# Altium project Brakelight.PrjPcb
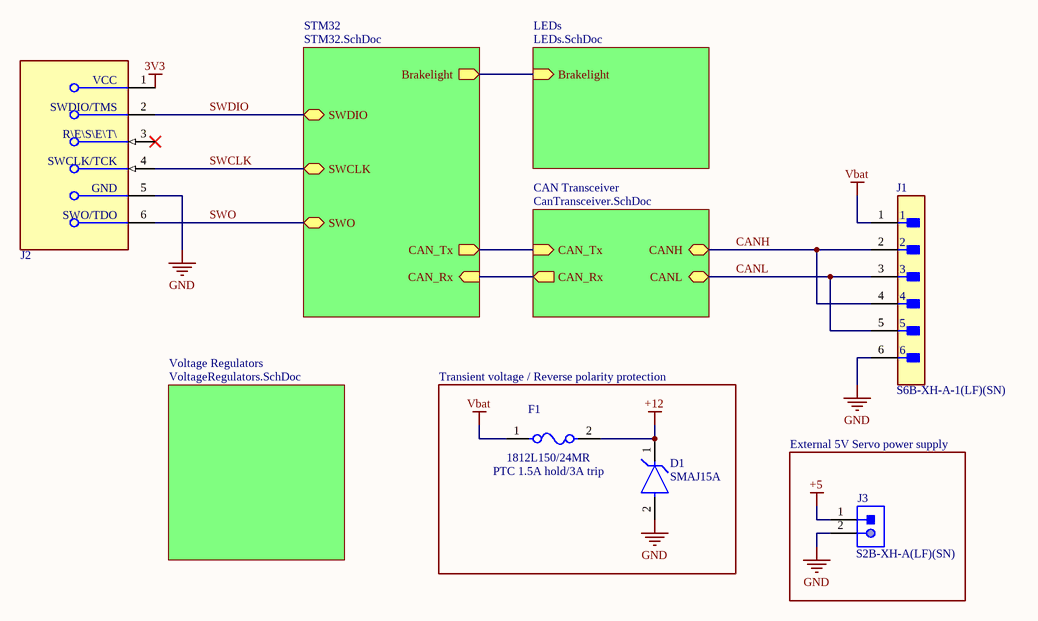
[diagram p0: Brakelight.SchDoc]
5 sheets, 54 parts. Net scope: hierarchical (ports join the sheet entries above them; power ports are global).
Board file: PCB.PcbDoc
Sheets:
  Brakelight.SchDoc
    Voltage Regulators = VoltageRegulators.SchDoc
    LEDs = LEDs.SchDoc
    STM32 = STM32.SchDoc
    CAN Transceiver = CanTransceiver.SchDoc

## Sheet Brakelight.SchDoc
size A; SheetNumber: 1; SheetTotal: 5

### Parts
D1  SMAJ15A  [FP-SMA-MFG]
F1  1812L150/24MR  [FP-1812L-MFG]
J1  S6B-XH-A-1(LF)(SN)  [FP-S6B-XH-A-1_LF_SN-MFG]
J2  TC2030-CTX-NL  [Tag_Connect_0_MFG]  (value not drawn)
J3  S2B-XH-A(LF)(SN)  [JST-S2B-XH-A(LF)(SN)_V]

### Blocks framed on the sheet
External 5V Servo power supply: J3

### Sub-sheets
CAN Transceiver = CanTransceiver.SchDoc: CANL (bidir), CAN_Tx (in), CANH (bidir), CAN_Rx (out)
LEDs = LEDs.SchDoc: Brakelight (in)
STM32 = STM32.SchDoc: CAN_Tx (out), CAN_Rx (in), Brakelight (out), SWDIO (bidir), SWO (bidir), SWCLK (bidir)
Voltage Regulators = VoltageRegulators.SchDoc: no entries

### Nets
3V3: J2.1(VCC)
+5: J3.1
+12: D1.1(C) F1.2
GND: D1.2(A) J1.6 J2.5(GND) J3.2
Vbat: F1.1 J1.1
CANH: J1.2 J1.4 ; sheet CAN Transceiver/CANH
CANL: J1.3 J1.5 ; sheet CAN Transceiver/CANL
SWCLK: J2.4(SWCLK/TCK) ; sheet STM32/SWCLK
SWDIO: J2.2(SWDIO/TMS) ; sheet STM32/SWDIO
SWO: J2.6(SWO/TDO) ; sheet STM32/SWO
NetR7_1: sheet LEDs/Brakelight, sheet STM32/Brakelight
NetU2_32: sheet STM32/CAN_Rx, sheet CAN Transceiver/CAN_Rx
NetU2_33: sheet STM32/CAN_Tx, sheet CAN Transceiver/CAN_Tx

Not connected (* = marked no-connect by the designer): J2 3(~{RESET})*

### Notes on the sheet
- Transient voltage / Reverse polarity protection
- PTC 1.5A hold/3A trip

### Library data of the parts
D1 = CMP-07401-000026-1: TVS DIODE 15V 24.4V SMA; Manufacturer: Bourns Inc.; Max Junction Temp: +150°C; Peak Pulse Current: 16.4A; Direction: Unidirectional; Breakdown Voltage: 16.7V; Number Of Channels: 1; Peak Pulse Power: 400W; Mouser Description: Bourns Smaj15a / Diode Tvs 15v 400w Uni 5% Smd Bourns; Temperature Range Low: -55°C; ComponentLink2Description: Datasheet; Package: SMA; Reverse Standoff Voltage: 15V; Category: Diode; Device Class L2: TVS Diodes; Lead Free: Yes; RoHS: TRUE; Clamping Voltage: 24.4V; ComponentLink2URL: https://www.bourns.com/docs/Product-Datasheets/SMAJ.pdf; Digikey Description: TVS DIODE 15V 24.4V SMA; Temperature Range High: +150°C; Height: 2.29mm; Device Class L1: Circuit Protection; Device Class L3: unset; Temperature: -55°C to +150°C; Octopart: https://octopart.com/smaj15a-bourns-12809353; Manufacturer Part Number: SMAJ15A; Automotive: No
F1 = CMP-08606-000018-1: PTC RESET FUSE 24V 1.5A 1812; Manufacturer: Littelfuse Inc; Trip Current: 3A; Resistance: 0.04-0.12Ω; Current Rating: 20A; Trip Time: 1.5s; Value: 0.04-0.12Ω; Mouser Description: Resettable Fuses - PPTC 24V 1.5A-HD 40A MAX; Ipc Land Pattern Name: CAPC455324X130; Lead Free: Yes; Height: 1.8mm; RoHS: TRUE; Octopart: https://octopart.com/1812l150%2F24mr-littelfuse-7130198; Ambient Temperature Range Low: -40°C; Temperature Range High: +85°C; Automotive: No; Hold Current: 1.5A; Package: 1812L; ComponentLink2Description: Datasheet; Temperature: -40°C to +85°C; Digikey Description: PTC RESET FUSE 24V 1.5A 1812; Device Class L3: unset; ComponentLink2URL: https://www.littelfuse.com/~/media/electronics/datasheets/resettable_ptcs/littelfuse_ptc_1812l_datasheet.pdf.pdf; Voltage Rating: 24V; Device Class L2: PTC Resettable Fuses; Device Class L1: Circuit Protection; Temperature Range Low: -40°C; Manufacturer Part Number: 1812L150/24MR; Category: Fuse; Ambient Temperature Range High: +85°C
J1 = CMP-17439-000023-1: CONN HEADER R/A P6OS 2.5MM; Voltage Rating: 250V; Insulation Resistance: 1GR; Current Rating: 3A; Number of Positions: 6; Gender: Male; Mount: Through Hole; Material: Polyamide; Max Operating Temperature: 85°C; Contact Plating: Tin; Number of Rows: 1; Color: Natural; Termination: Crimp; Min Operating Temperature: -25°C; Pitch: 2.5mm; Lead Free: Lead Free; Contact Material: Brass
J3 = CMP-1755-00005-1: Male Header, Pitch 2.5 mm, 1 x 2 Position, Height 6.1 mm, Tail Length 3.4 mm, -25 to 85 degC, RoHS, Bulk; Type (Capacitors): X7R; Voltage Rating (DC): 100 V; Tolerance: 10%; Capacitance: 1 nF; Case\Package: Radial; Min Operating Temperature: -55 degC; Mount: Through Hole; Package Quantity: 500; PackageReference: S2B-XH-A(LF)(SN); ComponentLink1Description: Manufacturer URL; Max Operating Temperature: 125 degC; ComponentLink2Description: Datasheet; RoHSCompliant: true; PackageDescription: Male Header, Pitch 2.5 mm, 1 x 2 Position, Height 6.1 mm, Tail Length 3.4 mm; REACH SVHC: No SVHC; Packaging: Bulk; Width: 3.81 mm; Length: 5.33 mm; Height: 2.54 mm; Pins: 2; Radiation Hardening: No; ComponentLink1URL: http://www.jst.com/home2.html; Lead Pitch: 2.54 mm; DatasheetVersion: May-16; Voltage Rating: 100 V; ComponentLink2URL: http://www.jst-mfg.com/product/pdf/eng/eXH.pdf

## Sheet VoltageRegulators.SchDoc
size A; SheetNumber: 2; SheetTotal: 5
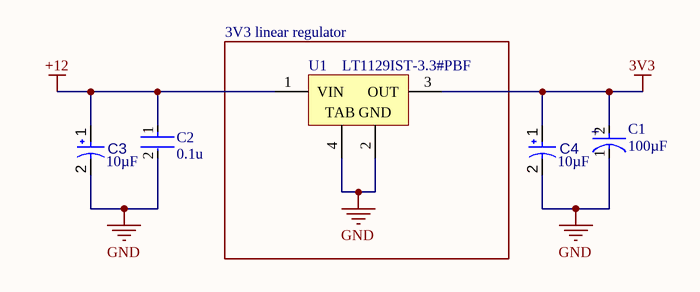
[diagram p1: VoltageRegulators.SchDoc]

### Parts
C1  100µF  [FP-T491X107K025AT-MFG]
C2  0.1u  [FP-C0603C-CF-MFG]
C3  value 10µF  [CAPMP3217X18-T_V]  (hidden comment: TAJA106K016RNJ)
C4  value 10µF  [CAPMP3217X18-T_V]  (hidden comment: TAJA106K016RNJ)
U1  LT1129IST-3.3#PBF  [LT-ST-3-SOT-223_L]

### Blocks framed on the sheet
3V3 linear regulator: U1

### Nets
3V3: C1.2(A) C4.1 U1.3(OUT)
+12: C2.1 C3.1 U1.1(VIN)
GND: C1.1(C) C2.2 C3.2 C4.2 U1.2(GND) U1.4(TAB)

### Notes on the sheet
- (in symbol CMP-2000-07204-2) +

### Library data of the parts
C1 = CMP-2000-07204-2: CAP TANT 100UF 10% 25V 2917; Leakage Current: 25uA; Ripple Current: 742mA; Polarity: Polar; Dissipation Factor: 8%; Life (Hours): 2000Hour; Dielectric Material: Tantalum; ESR (Equivalent Series Resistance): 300mR; Length: 7.3mm; RoHS Compliant: No; Failure Rate: 0.001%; REACH SVHC: No SVHC; Tolerance: 10%; Mount: Surface Mount; Height - Seated (Max): 0.169inch; Features: General Purpose; Height: 4mm; Package Quantity: 1; Case Code (Metric): 7343; Max Operating Temperature: 125°C; Number of Pins: 2; Radiation Hardening: No; Lead Free: Lead Free; Capacitance: 100uF; Termination: SMD/SMT; Voltage Rating: 25V; Series: T491; Depth: 4.3mm; Construction: Flat; Case/Package: 2917; Min Operating Temperature: -55°C; Voltage Rating (DC): 25V; Width: 4.3mm; Packaging: Tape and Reel; Case Code (Imperial): 2917; Voltage: 25V
C2 = CMP-2006-03061-2: CAP CER 0.1UF 50V X7R 0603; Manufacturer: KEMET; Manufacturer Part Number: C0603C104K5RACTU; Tolerance: 0.1; Temperature Coefficient: 30ppm/°C; Material: Ceramic; Automotive Grade: Grade 1; Value: 0.10 μF; Temperature: -55°C to +125°C; RoHS: TRUE; Temperature Range High: +125°C; Lead Free: Yes; Octopart: https://octopart.com/c0603c104k5ractu-kemet-139244; Digikey Description: CAP CER 0.1UF 50V X7R 0603; Category: Cap; Package: C0603C-CF; ComponentLink2Description: Datasheet; Temperature Range Low: -55°C; Device Class L1: Passive Components; Voltage Rating: 50 V; Automotive: Yes; Device Class L3: Ceramic Capacitors; ComponentLink2URL: https://api.kemet.com/component-edge/download/datasheet/C0603C100J5GACAUTO.pdf; Capacitance: 0.10 μF; Device Class L2: Capacitors; Temperature Characteristic: X7R; Height: 0.87mm
C3 C4 = CMP-001-00041-6: Standard Tantalum, 10 uF, +/- 10%, 16 V, -55 to 125 degC, 1206 (3216 Metric), RoHS, Tape and Reel; Manufacturer: AVX; Voltage Rating: 16V; ESR: 3Ohm; RoHS Compliant: True; Tolerance: 10%; Mounting Technology: SM; Min Operating Temperature: -55°C; Capacitor Type: Tantalum; Max Operating Temperature: 125°C; Case/Package: 1206; Pins: 2; Datasheet URL: http://datasheets.avx.com/TAJ.pdf; Datasheet Version: Feb-16; Manufacturer URL: http://www.avx.com/; Package Description: 2-Pin Surface Mount Device, Body 3.2 x 1.65 mm; Package Quantity: 1; Package Reference: CAPMP3217X18-T; Package URL: http://www.avx.com/download/software/literature/AVX-Footprint-Library.pdf; Packaging: TapeandReel
U1 = CMP-0476-01834-1: Micropower Low Dropout Regulator with Shutdown, 4.15 to 30 V Vin, 3.3 V Vout, 3-pin SOT223 (ST-3), -40 to 125 degC, Pb-Free; Manufacturer: Linear Technology; Vin Min(V): 4.15; Iout(mA): 700; Number of Outputs: 1; Vin Max(V): 30; Dropout Voltage(V): 0.45; PSRR(dB): 64; Discrete Pass Element: no; Shutdown Current(uA): 16; Output Voltage: 3.3 V; Isupply(mA): 0.05; RoHS: TRUE; PartNumber: LT1129IST-3.3#PBF; ComponentLink3URL: http://cds.linear.com/docs/en/packaging/SOT_3_05-08-1630.pdf; PackageReference: ST-3; ComponentLink3Description: Package Specification; PackageDescription: 3-Pin Plastic SOT-223, 3.505 x 6.505 mm Body, Pitch 2.3 mm; Mounting Technology: Surface Mount; DatasheetVersion: Rev. F; ComponentLink2URL: http://cds.linear.com/docs/en/datasheet/112935ff.pdf; ComponentLink1URL: http://www.linear.com/; PackageVersion: Jun-10; ComponentLink2Description: Datasheet; ComponentLink1Description: Manufacturer URL

## Sheet LEDs.SchDoc
size A; SheetNumber: 3; SheetTotal: 5
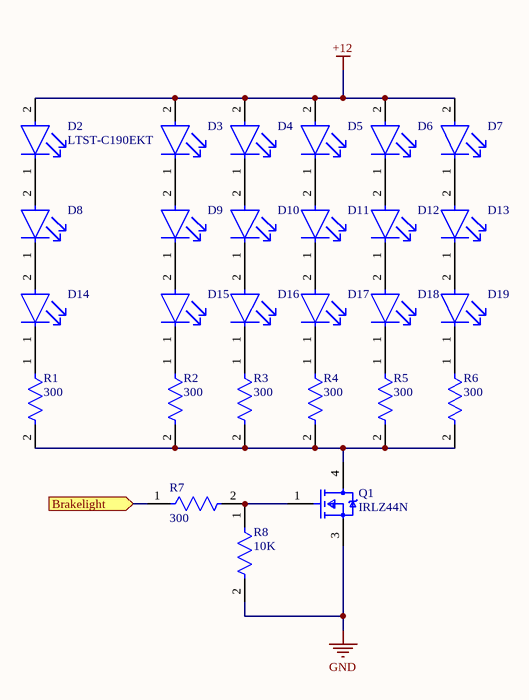
[diagram p2: LEDs.SchDoc]

### Parts
D2  LTST-C190EKT  [FP-LTST-C190EKT-MFG]
D3  LTST-C190EKT  [FP-LTST-C190EKT-MFG]  (value not drawn)
D4  LTST-C190EKT  [FP-LTST-C190EKT-MFG]  (value not drawn)
D5  LTST-C190EKT  [FP-LTST-C190EKT-MFG]  (value not drawn)
D6  LTST-C190EKT  [FP-LTST-C190EKT-MFG]  (value not drawn)
D7  LTST-C190EKT  [FP-LTST-C190EKT-MFG]  (value not drawn)
D8  LTST-C190EKT  [FP-LTST-C190EKT-MFG]  (value not drawn)
D9  LTST-C190EKT  [FP-LTST-C190EKT-MFG]  (value not drawn)
D10  LTST-C190EKT  [FP-LTST-C190EKT-MFG]  (value not drawn)
D11  LTST-C190EKT  [FP-LTST-C190EKT-MFG]  (value not drawn)
D12  LTST-C190EKT  [FP-LTST-C190EKT-MFG]  (value not drawn)
D13  LTST-C190EKT  [FP-LTST-C190EKT-MFG]  (value not drawn)
D14  LTST-C190EKT  [FP-LTST-C190EKT-MFG]  (value not drawn)
D15  LTST-C190EKT  [FP-LTST-C190EKT-MFG]  (value not drawn)
D16  LTST-C190EKT  [FP-LTST-C190EKT-MFG]  (value not drawn)
D17  LTST-C190EKT  [FP-LTST-C190EKT-MFG]  (value not drawn)
D18  LTST-C190EKT  [FP-LTST-C190EKT-MFG]  (value not drawn)
D19  LTST-C190EKT  [FP-LTST-C190EKT-MFG]  (value not drawn)
Q1  IRLZ44N  [FP-PG-TO263-3-MFG]
R1  300  [FP-CRCW1206-e3-IPC_A]
R2  300  [FP-CRCW1206-e3-IPC_A]
R3  300  [FP-CRCW1206-e3-IPC_A]
R4  300  [FP-CRCW1206-e3-IPC_A]
R5  300  [FP-CRCW1206-e3-IPC_A]
R6  300  [FP-CRCW1206-e3-IPC_A]
R7  300  [FP-CRCW1206-e3-IPC_A]
R8  10K  [FP-CRCW0603-e3-IPC_B]

### Ports
Brakelight (in)

### Nets
+12: D2.2(A) D3.2(A) D4.2(A) D5.2(A) D6.2(A) D7.2(A)
GND: Q1.3(S) R8.2
NetD2_1: D2.1(C) D8.2(A)
NetD3_1: D3.1(C) D9.2(A)
NetD4_1: D4.1(C) D10.2(A)
NetD5_1: D5.1(C) D11.2(A)
NetD6_1: D6.1(C) D12.2(A)
NetD7_1: D7.1(C) D13.2(A)
NetD8_1: D8.1(C) D14.2(A)
NetD9_1: D9.1(C) D15.2(A)
NetD10_1: D10.1(C) D16.2(A)
NetD11_1: D11.1(C) D17.2(A)
NetD12_1: D12.1(C) D18.2(A)
NetD13_1: D13.1(C) D19.2(A)
NetD14_1: D14.1(C) R1.1
NetD15_1: D15.1(C) R2.1
NetD16_1: D16.1(C) R3.1
NetD17_1: D17.1(C) R4.1
NetD18_1: D18.1(C) R5.1
NetD19_1: D19.1(C) R6.1
NetQ1_1: Q1.1(G) R7.2 R8.1
NetQ1_4: Q1.4(D) R1.2 R2.2 R3.2 R4.2 R5.2 R6.2
NetR7_1: R7.1 ; port Brakelight

### Library data of the parts
D2-D19 = CMP-22017-000021-1: LED RED CLEAR CHIP SMD; Power Dissipation: 100mW; Lens Color: Colorless; Viewing Angle: 130°; Wavelength: 630nm; Number of Elements: 1; Reverse Voltage: 5V; Forward Current: 30mA; Dominant Wavelength: 621nm; Luminous Intensity: 2mcd; Test Current: 10mA; Forward Voltage: 2V; Length: 1.6mm; Lead Free: Lead Free; Lens Transparency: Clear; Max Operating Temperature: 85°C; Case Code (Metric): 1608; Case Code (Imperial): 0603; Number of Pins: 2; Color: Red; Depth: 0.8mm; Lens Style: Clear; Packaging: Tape and Reel; Height: 0.8mm; Case/Package: 0603; Min Operating Temperature: -55°C; Number of LEDs: 1; Illumination Color: Red; Mount: Surface Mount; Package Quantity: 1; Max Power Dissipation: 100mW; Power Rating: 100mW; Width: 0.8mm; Radiation Hardening: No
Q1 = CMP-32901-000495-1: MOSFET N-CH 55V 47A D2PAK; Rds On Max: 22mR; Input Capacitance: 1.7nF; Turn-On Delay Time: 11ns; Turn-Off Delay Time: 26ns; Power Dissipation: 110W; Element Configuration: Single; Gate to Source Voltage (Vgs): 16V; Drain to Source Resistance: 35mR; Threshold Voltage: 2V; Max Power Dissipation: 3.8W; Lead Free: Contains Lead; Max Dual Supply Voltage: 55V; Width: 0.38inch; Mount: Surface Mount; Continuous Drain Current (ID): 47A; Min Operating Temperature: -55°C; Number of Pins: 3; REACH SVHC: No SVHC; Height: 0.19inch; Length: 0.42inch; Case/Package: D2PAK; Drain to Source Breakdown Voltage: 55V; Packaging: Tape and Reel; Drain to Source Voltage (Vdss): 55V; Halogen Free: Halogen Free; RoHS Compliant: Yes; Max Operating Temperature: 175°C
R1-R7 = CMP-1014-00449-3: RES Thick Film, 300Ω, 1%, 0.25W, 100ppm/°C, 1206; Voltage Rating (DC): 200V; Power Rating: 250mW; Resistance: 300R; Number of Terminations: 2; Weight: 0.000353oz; Max Operating Temperature: 155°C; Features: Automotive AEC-Q200; Min Operating Temperature: -55°C; Case Code (Imperial): 1206; Voltage Rating: 200V; Termination: SMD/SMT; Military Standard: Not; Composition: Thick Film; Tolerance: 1%; Mount: Surface Mount; Package Quantity: 10; Length: 3.2mm; Depth: 1.6mm; Temperature Coefficient: 100ppm/°C; Width: 0.063inch; Contact Plating: Tin; Lead Free: Lead Free; Case Code (Metric): 3216; Radiation Hardening: No; Max Power Dissipation: 250mW; Working Voltage: 200V; Packaging: Tape and Reel; Height: 0.55mm; Case/Package: 1206
R8 = CMP-2000-03836-2: RES Thick Film, 10kΩ, 1%, 0.1W, 100ppm/°C, 0603; Voltage Rating: 75V; Max Power Dissipation: 100mW; Resistance: 10kR; Min Operating Temperature: -55°C; Packaging: Tape and Reel; Temperature Coefficient: 100ppm/°C; Case/Package: 0603; Max Operating Temperature: 155°C; Package Quantity: 10000; Voltage Rating (DC): 75V; Depth: 0.85mm; Case Code (Imperial): 0603; Power Rating: 100mW; Military Standard: Not; Height: 0.02inch; Weight: 7.1E-05oz; Number of Pins: 2; Width: 0.033inch; Number of Terminations: 2; Contact Plating: Tin; Length: 1.55mm; Features: Automotive AEC-Q200; Lead Free: Lead Free; Tolerance: 1%; Composition: Thick Film; Radiation Hardening: No; Case Code (Metric): 1608

## Sheet STM32.SchDoc
size A; SheetNumber: 4; SheetTotal: 5
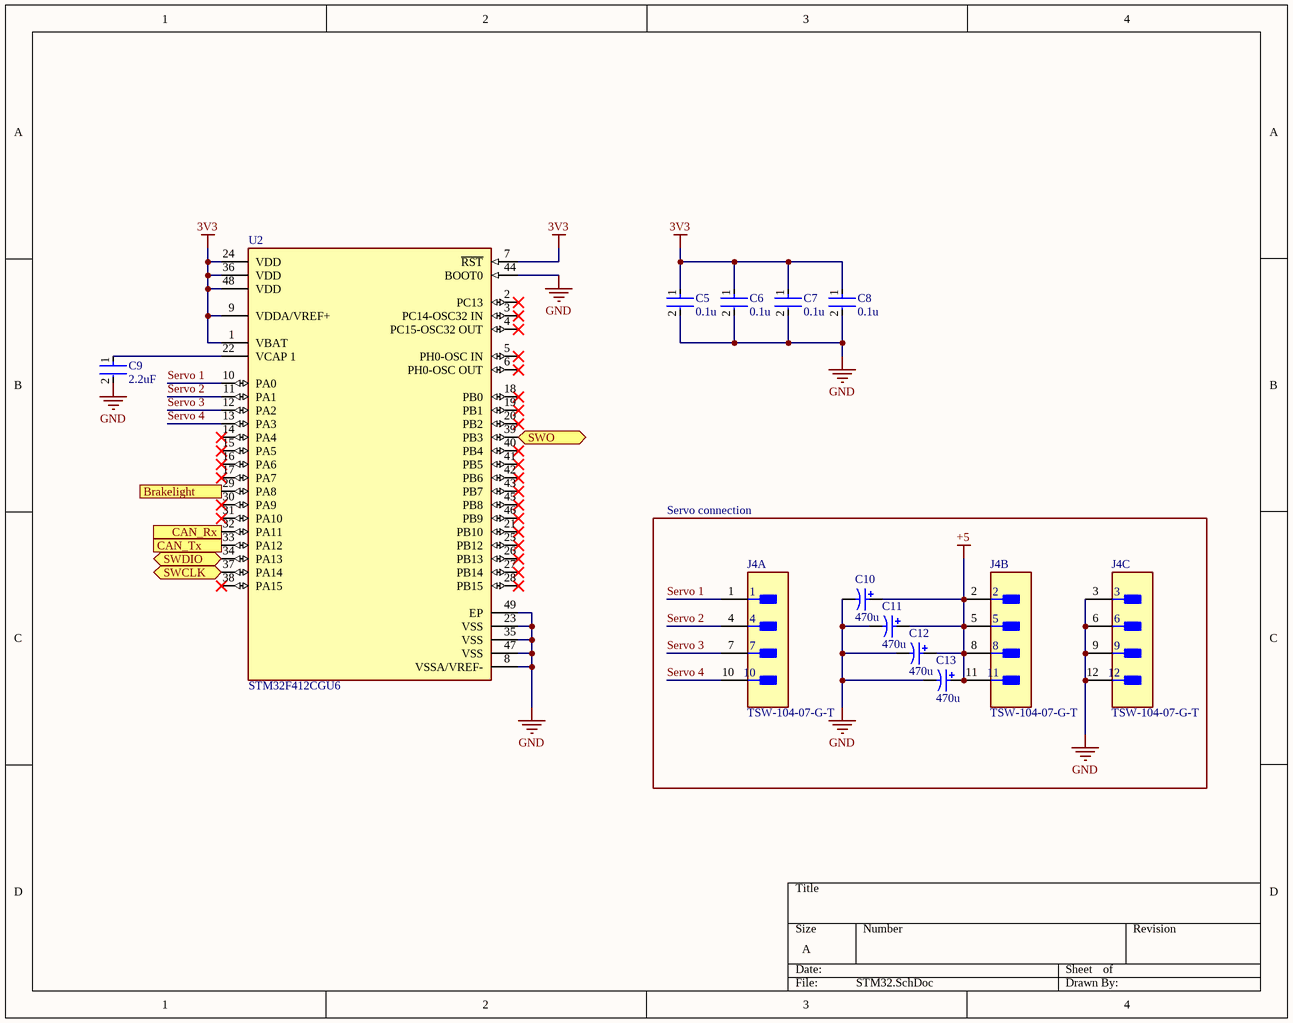
[diagram p3: STM32.SchDoc]

### Parts
C5  0.1u  [FP-C0603C-CF-MFG]
C6  0.1u  [FP-C0603C-CF-MFG]
C7  0.1u  [FP-C0603C-CF-MFG]
C8  0.1u  [FP-C0603C-CF-MFG]
C9  2.2uF  [FP-GRM188-0_1-e0_2_0_5-MFG]
C10  470u  [PNSC-FP-V-G_V]
C11  470u  [PNSC-FP-V-G_V]
C12  470u  [PNSC-FP-V-G_V]
C13  470u  [PNSC-FP-V-G_V]
J4  TSW-104-07-G-T  [FP-TSW-104-07-G-T-MFG]  (parts A,B,C of 3)
U2  STM32F412CGU6  [FP-UFQFPN48-A0B9-MFG]

### Blocks framed on the sheet
Servo connection: C10-C13 J4

### Ports
Brakelight (out), CAN_Rx (in), CAN_Tx (out), SWCLK (bidir), SWDIO (bidir), SWO (bidir)

### Nets
3V3: C5.1 C6.1 C7.1 C8.1 U2.1(VBAT) U2.7(~{RST}) U2.9(VDDA/VREF+) U2.24(VDD) U2.36(VDD) U2.48(VDD)
+5: C10.1 C11.1 C12.1 C13.1 J4.2 J4.5 J4.8 J4.11
GND: C5.2 C6.2 C7.2 C8.2 C9.2 C10.2 C11.2 C12.2 C13.2 J4.3 J4.6 J4.9 J4.12 U2.8(VSSA/VREF-) U2.23(VSS) U2.35(VSS) U2.44(BOOT0) U2.47(VSS) U2.49(EP)
Servo 1: J4.1 U2.10(PA0)
Servo 2: J4.4 U2.11(PA1)
Servo 3: J4.7 U2.12(PA2)
Servo 4: J4.10 U2.13(PA3)
SWCLK: U2.37(PA14) ; port SWCLK
SWDIO: U2.34(PA13) ; port SWDIO
SWO: U2.39(PB3) ; port SWO
NetC9_1: C9.1 U2.22(VCAP_1)
NetR7_1: U2.29(PA8) ; port Brakelight
NetU2_32: U2.32(PA11) ; port CAN_Rx
NetU2_33: U2.33(PA12) ; port CAN_Tx

Not connected (* = marked no-connect by the designer): U2 2(PC13)* 3(PC14-OSC32_IN)* 4(PC15-OSC32_OUT)* 5(PH0-OSC_IN)* 6(PH0-OSC_OUT)* 14(PA4)* 15(PA5)* 16(PA6)* 17(PA7)* 18(PB0)* 19(PB1)* 20(PB2)* 21(PB10)* 25(PB12)* 26(PB13)* 27(PB14)* 28(PB15)* 30(PA9)* 31(PA10)* 38(PA15)* 40(PB4)* 41(PB5)* 42(PB6)* 43(PB7)* 45(PB8)* 46(PB9)*

### Library data of the parts
C5-C8 = CMP-2006-03061-2: as C2 on sheet VoltageRegulators; Temperature: -55°C to +125°C; RoHS: TRUE; Temperature Range High: +125°C; Lead Free: Yes; Octopart: https://octopart.com/c0603c104k5ractu-kemet-139244; Digikey Description: CAP CER 0.1UF 50V X7R 0603; Category: Cap; Package: C0603C-CF; ComponentLink2Description: Datasheet; Temperature Range Low: -55°C; Device Class L1: Passive Components; Voltage Rating: 50 V; Automotive: Yes; Device Class L3: Ceramic Capacitors; ComponentLink2URL: https://api.kemet.com/component-edge/download/datasheet/C0603C100J5GACAUTO.pdf; Capacitance: 0.10 μF; Device Class L2: Capacitors; Temperature Characteristic: X7R; Height: 0.87mm
C9 = CMP-2006-02836-2: Chip Multilayer Ceramic Capacitors for General Purpose, 0603, 2.2uF, X7R, 15%, 10%, 10V; Case Code (Metric): 1608; Height: 0.8mm; Packaging: Cut Tape; Voltage: 10V; Lead Free: Lead Free; Min Operating Temperature: -55°C; Voltage Rating (DC): 10V; Max Operating Temperature: 125°C; Voltage Rating: 10V; Dielectric: X7R; Depth: 0.8mm; Case Code (Imperial): 0603; Termination: SMD/SMT; Case/Package: 0603; Number of Pins: 2; REACH SVHC: No SVHC; Mount: Surface Mount; Width: 0.031inch; Material: Ceramic; Capacitance: 2.2uF; Package Quantity: 1; Weight: 7.1E-05oz; Length: 1.6mm; Thickness: 0.035inch; Tolerance: 10%
C10-C13 = CMP-2000-06214-1: Aluminum Electrolytic Capacitor, 470 uF, +/- 20%, 25 V, 2-Pin SMD (Size Code G), -55 to 105 degC, RoHS, Tape and Reel; Manufacturer: Panasonic; Capacitance: 470µF; Ripple Current: 1190mA; ESR (Equivalent Series Resistance): 0.06O; Type: Can; Rated Voltage: 25V; Lifetime@Temperature: 2000Hrs@105°C; Package Reference: FP-V-G; Case Size/Dimension: Ø10x10.2mm; Mounting Technology: SurfaceMount; Datasheet Version: 03/2016; Datasheet URL: http://industrial.panasonic.com/cdbs/www-data/pdf/RDE0000/ABA0000C1184.pdf; Series: FP; Operating Temp Range: -55to+105°C; Operating Temp-Max: 105°C; Package URL: http://industrial.panasonic.com/cdbs/www-data/pdf/RDE0000/DME0000COL48.pdf; Package Description: 2-Pin Electrolytic Aluminum Capacitor, Body 10.3 x 10.3 mm; Manufacturer URL: http://www.panasonic.com/
J4 = CMP-1024-00347-2: CONN HEADER VERT 12POS 2.54MM; Manufacturer: Samtec; Conn Orientation: Straight; Number Of Contacts: 12; Conn Gender: Male; Automotive: No; RoHS: TRUE; Number Of Rows: 3; Footprint Url: http://suddendocs.samtec.com/prints/tsw-xxx-xx-x-x-xx-xxx-footprint.pdf; Manufacturer Part Number: TSW-104-07-G-T; Temperature Range High: +125°C; Device Class L2: Headers and Wire Housings; Digikey Description: CONN HEADER VERT 12POS 2.54MM; Pitch: 2.54mm; Device Class L1: Connectors; Category: Conn; Device Class L3: unset; Octopart: https://octopart.com/tsw-104-07-g-t-samtec-8296723; Package: TSW-104-07-G-T; Lead Free: Yes; Height: 8.64mm; ComponentLink2Description: Datasheet; Contact Material: Gold,Nickel; Temperature Range Low: -55°C; ComponentLink2URL: http://suddendocs.samtec.com/prints/tsw-xxx-xx-xxx-x-xx-xxx-mkt.pdf; Temperature: -55°C to +125°C
U2 = CMP-12105-000086-1: IC MCU 32BIT 1MB FLASH 48UFQFPN; Frequency: 100MHz; Peripherals: Brown-out Detect/Reset; Number of I/Os: 36; Interface: I2C; Core Architecture: ARM; Oscillator Type: Internal; Memory Type: FLASH; Memory Size: 1MB; Min Operating Temperature: -40°C; Max Operating Temperature: 85°C

## Sheet CanTransceiver.SchDoc
size A; SheetNumber: 5; SheetTotal: 5
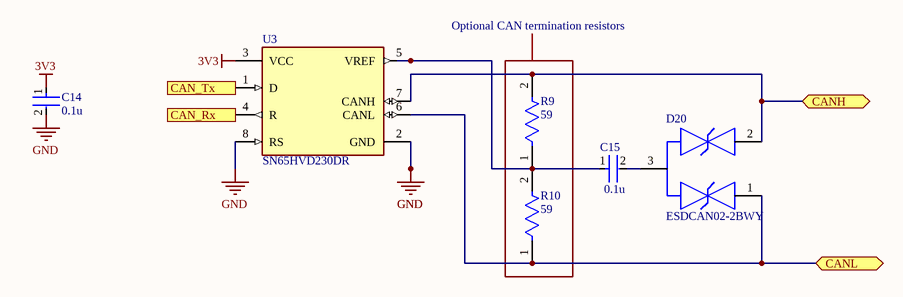
[diagram p4: CanTransceiver.SchDoc]

### Parts
C14  0.1u  [FP-C0603C-CF-MFG]
C15  0.1u  [FP-C0603C-CF-MFG]
D20  ESDCAN02-2BWY  [FP-SOT323-3L-MFG]
R9  59  [FP-CRCW0805-e3-IPC_B]
R10  59  [FP-CRCW0805-e3-IPC_B]
U3  SN65HVD230DR  [FP-D0008A-IPC_A]

### Ports
CAN_Rx (out), CAN_Tx (in), CANH (bidir), CANL (bidir)

### Nets
3V3: C14.1 U3.3(VCC)
GND: C14.2 U3.2(GND) U3.8(RS)
CANH: D20.2 R9.2 U3.7(CANH) ; port CANH
CANL: D20.1 R10.1 U3.6(CANL) ; port CANL
NetC15_1: C15.1 R9.1 R10.2 U3.5(VREF)
NetC15_2: C15.2 D20.3
NetU2_32: U3.4(R) ; port CAN_Rx
NetU2_33: U3.1(D) ; port CAN_Tx

### Notes on the sheet
- Optional CAN termination resistors

### Library data of the parts
C14 C15 = CMP-2006-03061-2: as C2 on sheet VoltageRegulators; Temperature: -55°C to +125°C; RoHS: TRUE; Temperature Range High: +125°C; Lead Free: Yes; Octopart: https://octopart.com/c0603c104k5ractu-kemet-139244; Digikey Description: CAP CER 0.1UF 50V X7R 0603; Category: Cap; Package: C0603C-CF; ComponentLink2Description: Datasheet; Temperature Range Low: -55°C; Device Class L1: Passive Components; Voltage Rating: 50 V; Automotive: Yes; Device Class L3: Ceramic Capacitors; ComponentLink2URL: https://api.kemet.com/component-edge/download/datasheet/C0603C100J5GACAUTO.pdf; Capacitance: 0.10 μF; Device Class L2: Capacitors; Temperature Characteristic: X7R; Height: 0.87mm
D20 = CMP-12225-000055-1: TVS DIODE 26.5V 44V SOT323-3; Manufacturer: STMicroelectronics; Value: 3pF; Direction: Bidirectional; Breakdown Voltage: 28.5V; Automotive Grade: Grade 0; Standoff Height: 0mm; Peak Pulse Power: 170W; Peak Pulse Current: 3A; Number Of Channels: 2; Max Junction Temp: +175°C; Mouser Description: TVS Diodes / ESD Suppressors Automotive dual-line Transil, Transient voltage suppressor (TVS) for CAN bus; Height: 1.1mm; Category: Diode; Reverse Standoff Voltage: 26.5V; Device Class L1: Circuit Protection; Temperature: -55°C to +175°C; RoHS: TRUE; ComponentLink2URL: https://www.st.com/resource/en/datasheet/esdcan02-2bwy.pdf; Device Class L3: unset; Device Class L2: TVS Diodes; Temperature Range High: +175°C; Octopart: https://octopart.com/esdcan02-2bwy-stmicroelectronics-58631133; Ipc Land Pattern Name: SOT65P210X95-3; Temperature Range Low: -55°C; Capacitance: 3pF; Digikey Description: TVS DIODE 26.5V 44V SOT323-3; Automotive: Yes; ComponentLink2Description: Datasheet; Clamping Voltage: 44V; Manufacturer Part Number: ESDCAN02-2BWY; Lead Free: Yes; Package: SOT323-3L
R9 R10 = CMP-02407-002414-1: RES Thick Film, 59Ω, 1%, 0.125W, 100ppm/°C, 0805; Power Rating: 125mW; Voltage Rating (DC): 150V; Resistance: 59R; Length: 2mm; Mount: Surface Mount; Military Standard: Not; Min Operating Temperature: -55°C; Number of Pins: 2; Height: 0.02inch; Weight: 0.000194oz; Case Code (Metric): 2012; Features: Automotive AEC-Q200; Width: 1.25mm; Tolerance: 1%; Max Operating Temperature: 155°C; Temperature Coefficient: 100ppm/°C; Depth: 1.25mm; Termination: SMD/SMT; Package Quantity: 10; Number of Terminations: 2; Packaging: Tape and Reel; Radiation Hardening: No; Composition: Thick Film; Lead Free: Lead Free; Case Code (Imperial): 0805; Case/Package: 0805; Contact Plating: Tin; Max Power Dissipation: 125mW; Voltage Rating: 150V
U3 = CMP-0315-00015-3: IC TRANSCEIVER HALF 1/1 8SOIC; Number of Transceivers: 1; Operating Supply Voltage: 3.3V; Number of I/Os: 2; Max Supply Current: 17mA; Max Supply Voltage: 3.6V; Min Supply Voltage: 3V; Data Rate: 1Mbps; Min Operating Temperature: -40°C; Packaging: Tape and Reel; Lead Free: Lead Free; Number of Transmit Buffers: 1; Max Operating Temperature: 85°C; Number of Receive Buffers: 1; Number of Pins: 8; Package Quantity: 1; Radiation Hardening: No; Case/Package: D; REACH SVHC: No SVHC; Weight: 0.002561oz; Termination: SMD/SMT; Contact Plating: Gold; Nominal Supply Current: 17mA; Number of Receivers: 1; Number of Drivers: 1

## Nets that join several sheets
3V3: Brakelight (J2.1), VoltageRegulators (C1.2 C4.1 U1.3), STM32 (10 pins), CanTransceiver (C14.1 U3.3)
+5: Brakelight (J3.1), STM32 (8 pins)
+12: Brakelight (D1.1 F1.2), VoltageRegulators (C2.1 C3.1 U1.1), LEDs (6 pins)
GND: Brakelight (D1.2 J1.6 J2.5 J3.2), VoltageRegulators (6 pins), LEDs (Q1.3 R8.2), STM32 (19 pins), CanTransceiver (C14.2 U3.2 U3.8)
CANH: Brakelight (J1.2 J1.4), CanTransceiver (D20.2 R9.2 U3.7)
CANL: Brakelight (J1.3 J1.5), CanTransceiver (D20.1 R10.1 U3.6)
NetR7_1: LEDs (R7.1), STM32 (U2.29)
NetU2_32: STM32 (U2.32), CanTransceiver (U3.4)
NetU2_33: STM32 (U2.33), CanTransceiver (U3.1)
SWCLK: Brakelight (J2.4), STM32 (U2.37)
SWDIO: Brakelight (J2.2), STM32 (U2.34)
SWO: Brakelight (J2.6), STM32 (U2.39)